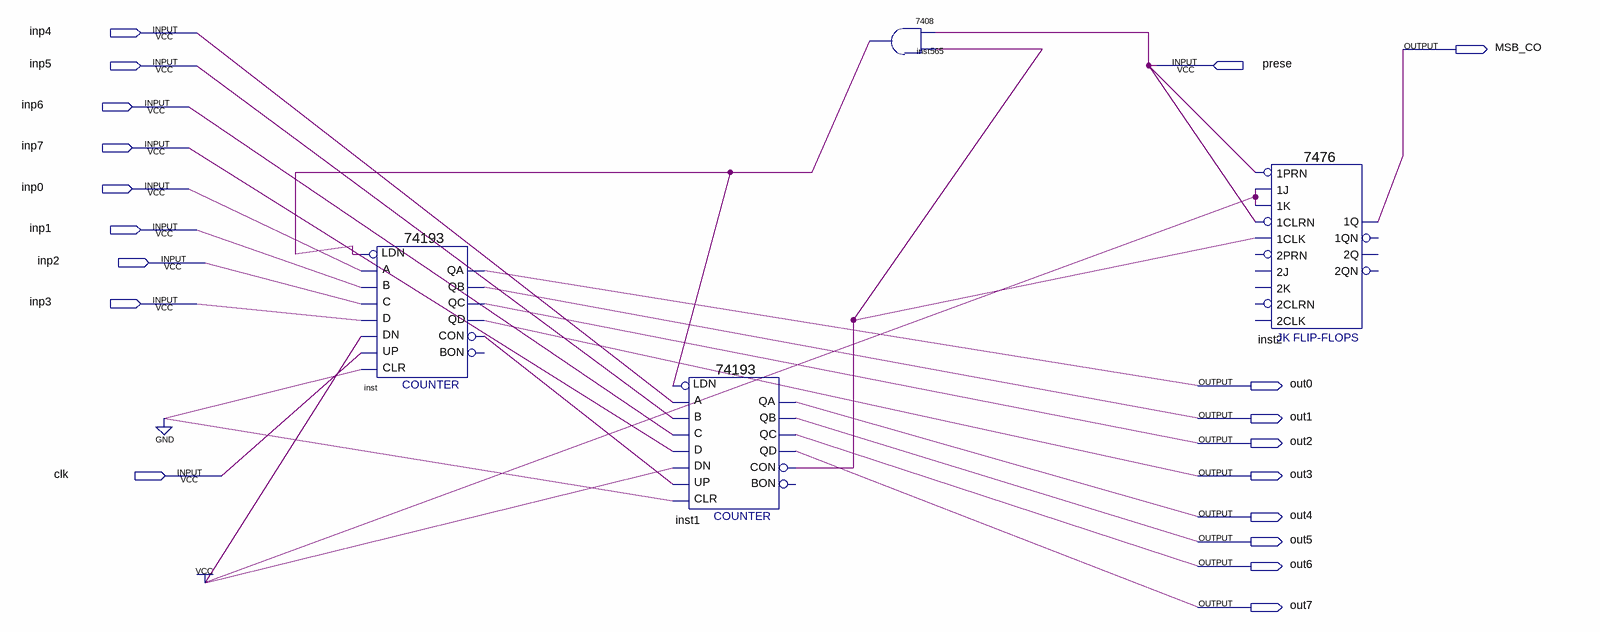
[diagram p0: schematic sheet]
// Quartus schematic fc2.bdf as structural Verilog: 4 symbols, 19 pins
module fc2 (
  input  inp4,
  input  inp5,
  input  prese,
  input  inp6,
  input  inp7,
  input  inp0,
  input  inp1,
  input  inp2,
  input  inp3,
  input  clk,
  output MSB_CO,
  output out0,
  output out1,
  output out2,
  output out3,
  output out4,
  output out5,
  output out6,
  output out7
);

  wire inst1_con, inst565_1, inst_con;

  \74193  inst (
    .D(inp3), .C(inp2), .B(inp1), .A(inp0), .CLR(1'b0), .UP(clk), .DN(1'b1), .LDN(inst565_1), .QB(out1),
    .QA(out0), .CON(inst_con), .QD(out3), .QC(out2));  // open: BON
  \74193  inst1 (
    .D(inp7), .C(inp6), .B(inp5), .A(inp4), .CLR(1'b0), .UP(inst_con), .DN(1'b1), .LDN(inst565_1), .QB(out5),
    .QA(out4), .CON(inst1_con), .QD(out7), .QC(out6));  // open: BON
  \7408  inst565 (.\3 (inst1_con), .\2 (prese), .\1 (inst565_1));
  \7476  inst2 (
    .\1J (1'b1), .\1K (1'b1), .\1PRN (prese), .\1CLK (inst1_con), .\1CLRN (prese), .\1Q (MSB_CO));  // open: 2PRN, 2J, 2K, 2CLRN, 2CLK, 2QN, 2Q, 1QN
endmodule
